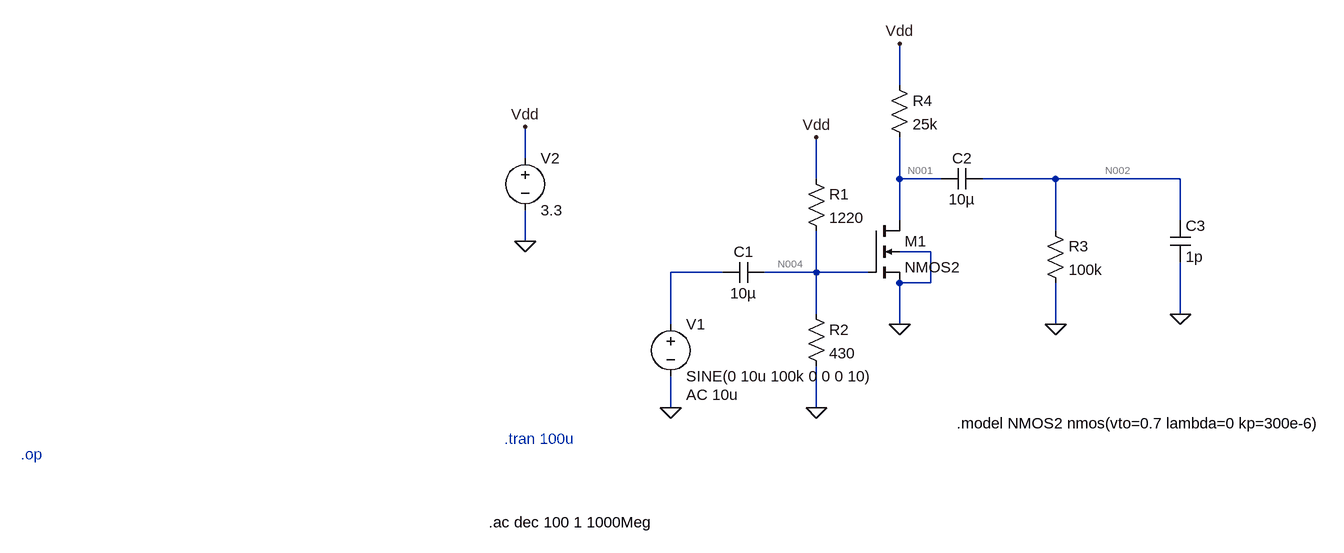
[diagram p0: schematic 1c.asc]
1c.asc, the LTspice schematic file:
Version 4.1
SHEET 1 1152 680
WIRE 448 -208 448 -272
WIRE -128 -96 -128 -144
WIRE 320 -64 320 -128
WIRE 448 -64 448 -128
WIRE 512 -64 448 -64
WIRE 688 -64 576 -64
WIRE 880 -64 688 -64
WIRE 448 0 448 -64
WIRE 880 0 880 -64
WIRE 688 16 688 -64
WIRE -128 32 -128 -16
WIRE 496 48 448 48
WIRE 176 80 96 80
WIRE 320 80 320 16
WIRE 320 80 240 80
WIRE 400 80 320 80
WIRE 496 96 496 48
WIRE 496 96 448 96
WIRE 320 144 320 80
WIRE 880 144 880 64
WIRE 96 160 96 80
WIRE 448 160 448 96
WIRE 688 160 688 96
WIRE 96 288 96 240
WIRE 320 288 320 224
FLAG 320 -128 Vdd
FLAG -128 -144 Vdd
FLAG -128 32 0
FLAG 320 288 0
FLAG 96 288 0
FLAG 448 160 0
FLAG 688 160 0
FLAG 448 -272 Vdd
FLAG 880 144 0
SYMBOL voltage 96 144 R0
WINDOW 123 24 124 Left 2
WINDOW 39 0 0 Left 0
SYMATTR Value2 AC 10u
SYMATTR InstName V1
SYMATTR Value SINE(0 10u 100k 0 0 0 10)
SYMBOL voltage -128 -112 R0
SYMATTR InstName V2
SYMATTR Value 3.3
SYMBOL cap 240 64 R90
WINDOW 0 0 32 VBottom 2
WINDOW 3 32 32 VTop 2
SYMATTR InstName C1
SYMATTR Value 10µ
SYMBOL res 304 -80 R0
SYMATTR InstName R1
SYMATTR Value 1220
SYMBOL res 304 128 R0
SYMATTR InstName R2
SYMATTR Value 430
SYMBOL nmos4 400 0 R0
SYMATTR InstName M1
SYMATTR Value NMOS2
SYMATTR Value2 l=1 w=26.05
SYMBOL res 672 0 R0
SYMATTR InstName R3
SYMATTR Value 100k
SYMBOL res 432 -224 R0
SYMATTR InstName R4
SYMATTR Value 25k
SYMBOL cap 576 -80 R90
WINDOW 0 0 32 VBottom 2
WINDOW 3 32 32 VTop 2
SYMATTR InstName C2
SYMATTR Value 10µ
SYMBOL cap 864 0 R0
SYMATTR InstName C3
SYMATTR Value 1p
TEXT 536 312 Left 2 !.model NMOS2 nmos(vto=0.7 lambda=0 kp=300e-6)
TEXT -160 336 Left 2 ;.tran 100u
TEXT -904 360 Left 2 ;.op
TEXT -184 464 Left 2 !.ac dec 100 1 1000Meg

The netlist it stands for:
* 1c.asc
V1 N003 0 SINE(0 10u 100k 0 0 0 10) AC 10u
V2 Vdd 0 3.3
C1 N004 N003 10µ
R1 Vdd N004 1220
R2 N004 0 430
M1 N001 N004 0 0 NMOS2 l=1 w=26.05
R3 N002 0 100k
R4 Vdd N001 25k
C2 N002 N001 10µ
C3 N002 0 1p
.model NMOS NMOS
.model PMOS PMOS
.lib standard.mos
.model NMOS2 nmos(vto=0.7 lambda=0 kp=300e-6)
* .tran 100u
* .op
.ac dec 100 1 1000Meg
.backanno
.end

* Results of the author's LTspice run, read from the files saved beside the schematic
* Operating Point, zero values left out:
*   V(vdd) = 3.3 V
*   V(n001) = 799.2 mV
*   V(n004) = 860 mV
*   I(R2) = 2 mA
*   Id(M1) = 100 µA
*   Is(M1) = -100 µA
*   I(R4) = 100 µA
*   I(V2) = -2.1 mA
*   I(R1) = 2 mA
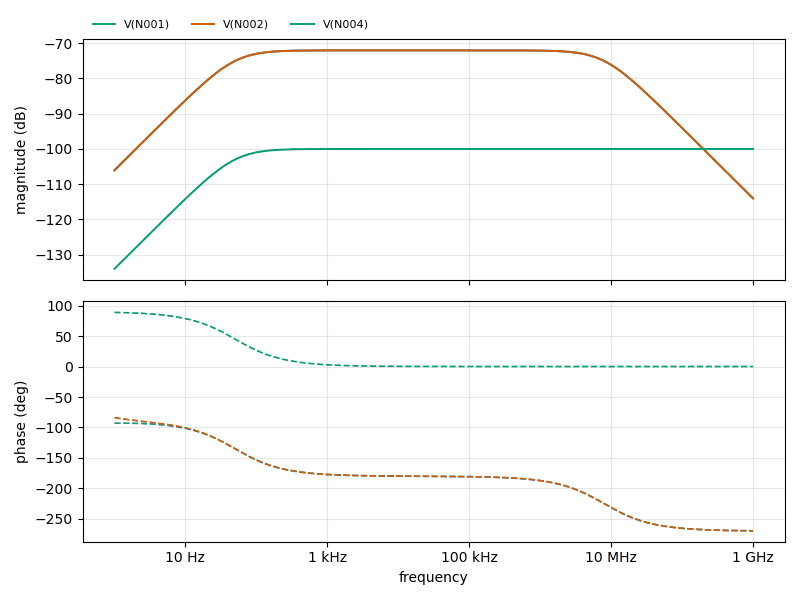
[diagram p1: AC Analysis of 1c.asc, plotted from the saved traces]
* AC Analysis, 1 run:
*   V(N001): -105.99 dB at 1 Hz, -114.02 dB at 1 GHz, peak -72.04 dB at 19.95 kHz, 3 dB below the peak at 50.06 Hz and 7.958 MHz
*   V(N002): -106.10 dB at 1 Hz, -114.02 dB at 1 GHz, peak -72.04 dB at 19.95 kHz, 3 dB below the peak at 50.06 Hz and 7.958 MHz
*   V(N004): -133.99 dB at 1 Hz, -100.00 dB at 1 GHz, peak -100.00 dB at 660.7 MHz, 3 dB below the peak at 50.06 Hz